# Altium project alarm_to_uart.PrjPcb
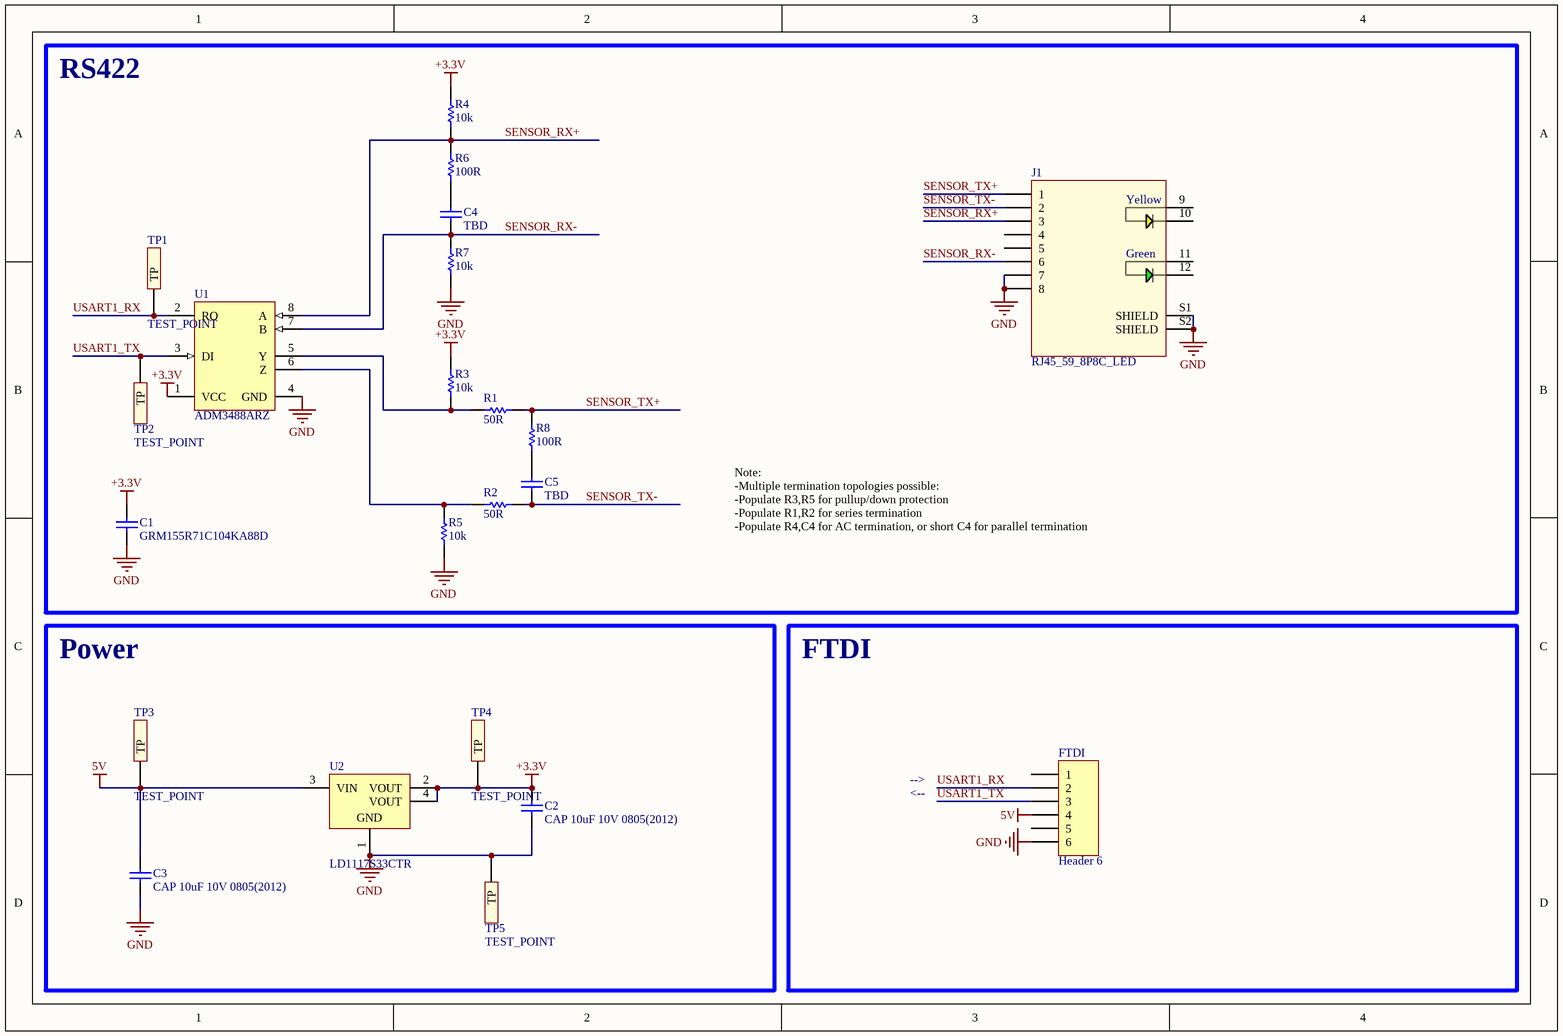
[diagram p0: alarm_to_uart.SchDoc]
1 sheet, 22 parts. Net scope: global (net labels, ports and power ports of the same name join across sheets).
Board file: alarm_to_uart.PcbDoc

## Sheet alarm_to_uart.SchDoc
size A4; Organization: Blinkinlabs, LLC

### Parts
C1  GRM155R71C104KA88D  [CAPC1005X55X25ML05T10]
C2  CAP 10uF 10V 0805(2012)  [CAPC0805(2012)145_N]
C3  CAP 10uF 10V 0805(2012)  [CAPC0805(2012)145_N]
C4  TBD  [CAPC1005X55X25ML05T10]
C5  TBD  [CAPC1005X55X25ML05T10]
FTDI  Header 6  [HDR1X6]
J1  RJ45_59_8P8C_LED  [RJ45_59_8P8C_LED]
R1  50R  [RESC0603(1608)_L]
R2  50R  [RESC0603(1608)_L]
R3  10k  [RESC0603(1608)_L]
R4  10k  [RESC0603(1608)_L]
R5  10k  [RESC0603(1608)_L]
R6  100R  [RESC0603(1608)_L]
R7  10k  [RESC0603(1608)_L]
R8  100R  [RESC0603(1608)_L]
TP1  TEST_POINT  [TP-SMD-1mm]  (no BOM)
TP2  TEST_POINT  [TP-SMD-1mm]  (no BOM)
TP3  TEST_POINT  [TP-SMD-1mm]  (no BOM)
TP4  TEST_POINT  [TP-SMD-1mm]  (no BOM)
TP5  TEST_POINT  [TP-SMD-1mm]  (no BOM)
U1  ADM3488ARZ  [ADI-R-8_L]
U2  LD1117S33CTR  [SOT-223_N]

### Blocks framed on the sheet
RS422: C1 C4 C5 J1 R1-R8 TP1 TP2 U1
Power: C2 C3 TP3-TP5 U2
FTDI: FTDI

### Nets
5V: C3.2 FTDI.4 TP3.1(TP) U2.3(VIN)
+3.3V: C1.2 C2.2 R3.1 R4.1 TP4.1(TP) U1.1(VCC) U2.2(VOUT) U2.4(VOUT)
GND: C1.1 C2.1 C3.1 FTDI.6 J1.7 J1.8 J1.S1(SHIELD) J1.S2(SHIELD) R5.2 R7.2 TP5.1(TP) U1.4(GND) U2.1(GND)
SENSOR_RX+: J1.3 R4.2 R6.1 U1.8(A)
SENSOR_RX-: C4.1 J1.6 R7.1 U1.7(B)
SENSOR_TX+: J1.1 R1.1 R8.1
SENSOR_TX-: C5.1 J1.2 R2.1
USART1_RX: FTDI.2 TP1.1(TP) U1.2(RO)
USART1_TX: FTDI.3 TP2.1(TP) U1.3(DI)
NetC4_2: C4.2 R6.2
NetC5_2: C5.2 R8.2
NetR1_2: R1.2 R3.2 U1.5(Y)
NetR2_2: R2.2 R5.1 U1.6(Z)

Not connected (* = marked no-connect by the designer): FTDI 1 5; J1 4 5 9(Yellow_Anode) 10(Yellow_Cathode) 11(Green_Anode) 12(Green_Cathode)

### Notes on the sheet
- Note:
  -Multiple termination topologies possible:
  -Populate R3,R5 for pullup/down protection
  -Populate R1,R2 for series termination
  -Populate R4,C4 for AC termination, or short C4 for parallel termination
- -->
- <--
- Title:
- Project:
- Revision:
- Date:
- Time:
- Sheet
- of
- (in symbol RJ45_59_8P8C_LED) Yellow; Green

### Library data of the parts
C1 C4 C5 = CMP-2100-03641-1: Chip Capacitor, 0.1 uF, +/- 10%, 16 V, -55 to 125 degC, 0402 (1005 Metric), RoHS, Tape and Reel; Manufacturer: Murata; Material: Ceramic; Insulation Resistance: 10GR; Voltage: 16V; Dielectric: X7R; Capacitance: 100nF; REACH SVHC: NoSVHC; Depth: 0.5mm; Case/Package: 0402; Datasheet URL: http://psearch.en.murata.com/capacitor/product/GRM155R71C104KA88%23.pdf; Lead Free: LeadFree; Dielectric Material: Ceramic; Manufacturer URL: http://www.murata.com/; Min Operating Temperature: -55degC; Length: 1mm; Case Code (Metric): 1005; Radiation Hardening: No; Package Reference: 0402; RoHSCompliant: true; Datasheet Version: 42675.0; Thickness: 0.022inch; Packaging: TapeandReel; Voltage Rating (DC): 16V; Tolerance: 10%; Max Operating Temperature: 125degC; Package Description: 2-Pin Surface Mount Device, Body 1 x 0.5 mm; Mount: SurfaceMount; Height: 0.5mm; Width: 0.5mm; Number of Pins: 2; Voltage Rating: 16V; Case Code (Imperial): 0402; Termination: SMD/SMT; Package Quantity: 1
C2 C3 = CMP-1036-04922-1: CAP 10uF 10V ±10% 0805 (2012 Metric) Thickness 1.45mm SMD; Tolerance: Â±10%; Case-EIA: 0805; Case-Metric: 2012; Value: 10uF; Technology: SMT; Rated Voltage: 10 V; Max Thickness: 1.45 mm
FTDI = Header 6: Header, 6-Pin; LatestRevisionDate: 17-Jul-2002; LatestRevisionNote: Re-released for DXP Platform.; Publisher: Altium Limited
J1 = RJ45_59_8P8C_LED: Generic RJ49 jack with LED and without magnetics; Manufacturer: Unknown/Generic; PartNumber: RJ45_59_8P8C_LED
R1-R8 = CMP-1012-00052-1: 120R 0.1W 5% 0603 (1608 Metric)  SMD; Case-EIA: 0603; Value: 120.00 Ohm; Case-Metric: 1608; Technology: SMT; Power: 0.1 W; Tolerance: 5 %
TP1-TP5 = TEST_POINT: Test point
U1 = CMP-0535-00058-1: 3.3 V Slew Rate Limited, Full-Duplex, RS-485/RS-422 Transceivers, 3 to 3.6 V, -40 to 85 degC, 8-Pin SOIC (R-8), RoHS, Tube; Manufacturer: Analog Devices; Guaranteed Data Rate: 0.25 Mbps; Receiver Hysteresis: 50 mV; Number of Drivers: 1; Duplex: Full; ComponentLink2URL: http://www.analog.com/static/imported-files/data_sheets/ADM3483_3485_3488_3490_3491.pdf; Mounting Technology: Surface Mount; RoHS: TRUE; ComponentLink2Description: Datasheet; ComponentLink3URL: http://www.analog.com/media/en/package-pcb-resources/package/pkg_pdf/soic_narrow-r/r_8.pdf; ComponentLink3Description: Package Specification; DatasheetVersion: Rev. E; PackageDescription: 8-Pin Standard Small Outline Package, Body 4.9 x 3.9 mm, Pitch 1.27 mm; ComponentLink1Description: Manufacturer URL; Supply Voltage: 3 to 3.6 V; PackageVersion: 06/2006; PartNumber: ADM3488ARZ; Packing: Tube; ComponentLink1URL: http://www.analog.com/en/index.html; Temperature Range: -40 to 85 degC
U2 = CMP-0244-00307-1: Fixed Low Drop Positive Voltage Regulator, 3.3V, 4-Pin SOT-223, Tape and Reel; ComponentLink1URL: http://www.st.com; PackageVersion: 2010; ComponentLink1Description: Manufacturer URL; DatasheetVersion: 1/11/2011; ComponentLink2URL: http://www.st.com/internet/com/TECHNICAL_RESOURCES/TECHNICAL_LITERATURE/DATASHEET/CD00000544.pdf; PackageReference: SOT-223; ComponentLink2Description: Datasheet; PackageDescription: 4-Pin SOT-223 Package, 6.5 x 3.5 mm Body, 2.3 mm Pitch, 7 mm Lead Span